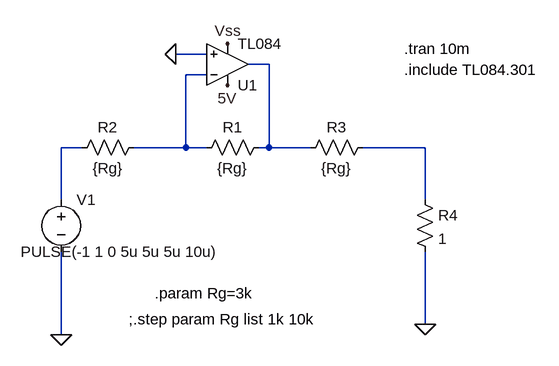
[diagram p0: schematic ganancia inversor.asc]
ganancia inversor.asc, the LTspice schematic file:
Version 4
SHEET 1 880 680
WIRE 320 112 272 112
WIRE 416 128 384 128
WIRE 320 144 288 144
WIRE 128 256 96 256
WIRE 288 256 288 144
WIRE 288 256 208 256
WIRE 320 256 288 256
WIRE 416 256 416 128
WIRE 416 256 400 256
WIRE 480 256 416 256
WIRE 656 256 560 256
WIRE 96 336 96 256
WIRE 656 336 656 256
WIRE 656 528 656 416
WIRE 96 544 96 416
FLAG 272 112 0
FLAG 352 96 Vss
FLAG 352 160 5V
FLAG 96 544 0
FLAG 656 528 0
SYMBOL voltage 96 320 R0
WINDOW 123 0 0 Left 2
WINDOW 39 0 0 Left 2
WINDOW 3 -62 96 Left 2
SYMATTR Value PULSE(-1 1 0 5u 5u 5u 10u)
SYMATTR InstName V1
SYMBOL res 416 240 R90
WINDOW 0 0 56 VBottom 2
WINDOW 3 32 56 VTop 2
SYMATTR InstName R1
SYMATTR Value {Rg}
SYMBOL res 224 240 R90
WINDOW 0 0 56 VBottom 2
WINDOW 3 32 56 VTop 2
SYMATTR InstName R2
SYMATTR Value {Rg}
SYMBOL res 576 240 R90
WINDOW 0 0 56 VBottom 2
WINDOW 3 32 56 VTop 2
SYMATTR InstName R3
SYMATTR Value {Rg}
SYMBOL opamp2 352 192 M180
SYMATTR InstName U1
SYMATTR Value TL084
SYMBOL res 640 320 R0
SYMATTR InstName R4
SYMATTR Value 1
TEXT 240 480 Left 2 !.param Rg=3k
TEXT 200 520 Left 2 !;.step param Rg list 1k 10k
TEXT 624 104 Left 2 !.tran 10m
TEXT 624 136 Left 2 !.include TL084.301

The netlist it stands for:
* ganancia inversor.asc
V1 N003 0 PULSE(-1 1 0 5u 5u 5u 10u)
R1 N001 N002 {Rg}
R2 N002 N003 {Rg}
R3 N004 N001 {Rg}
XU1 0 N002 5V Vss N001 TL084  ; pins In+ In- V+ V- OUT
R4 N004 0 1
.param Rg=3k
;.step param Rg list 1k 10k
.tran 10m
.include TL084.301
.backanno
.end